# Altium schematic sheet Power.SchDoc: Power
size A; Author: Craig Hesling; DrawnBy: Craig Hesling; Revision: 3
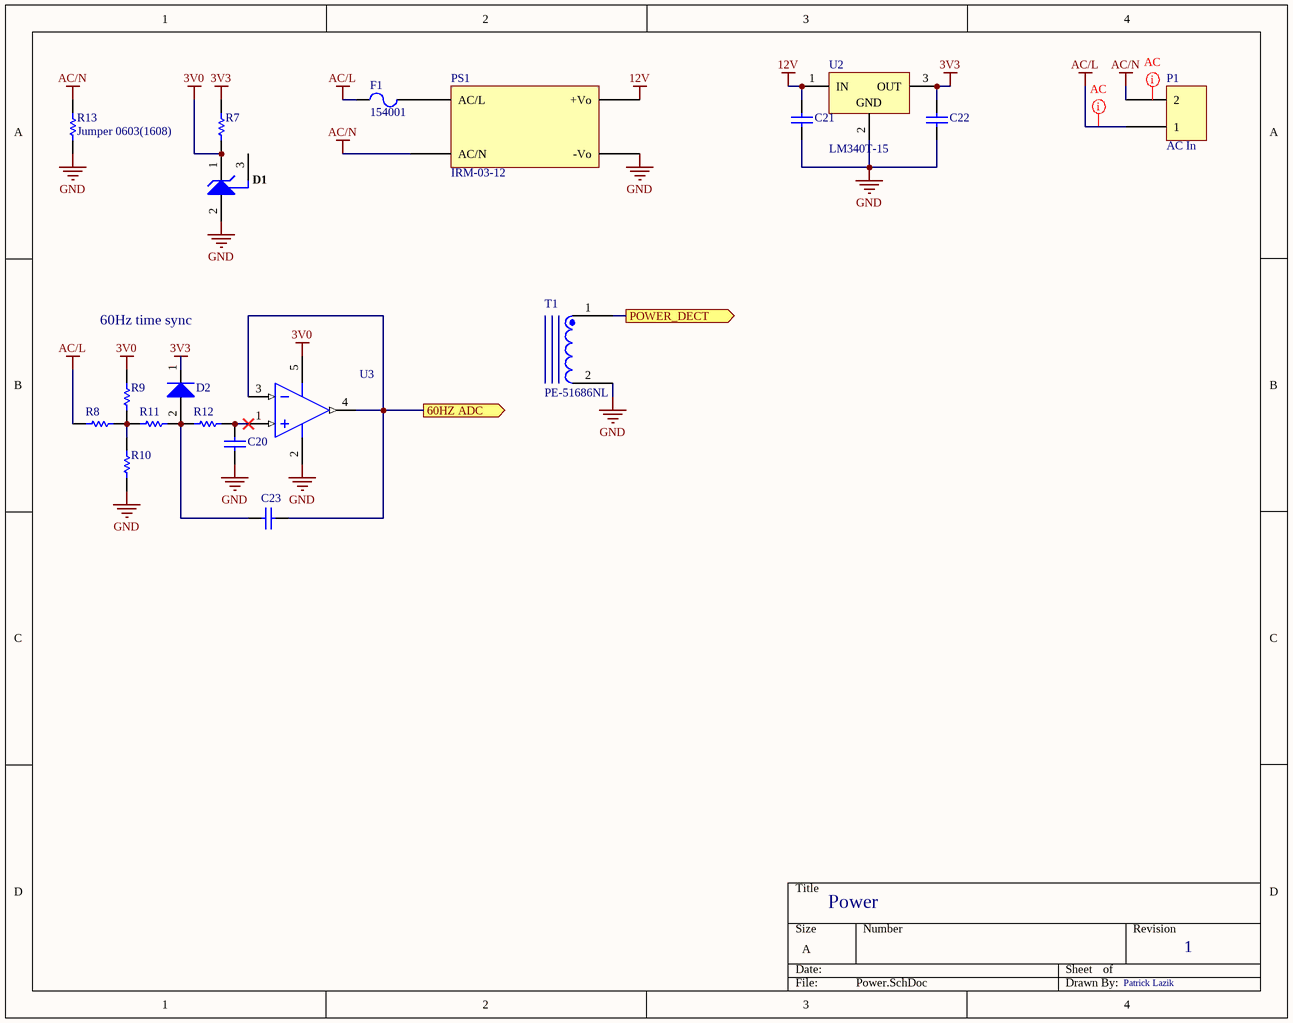
[diagram p0: Power.SchDoc]

## Parts
C20  CAP 100nF 6.3V 0603(1608)  [CAPC0603(1608)100_M]  (value not drawn)
C21  CAP 220nF 10V 0603(1608)  [CAPC0603(1608)100_L]  (value not drawn)
C22  CAP 220nF 10V 0603(1608)  [CAPC0603(1608)100_L]  (value not drawn)
C23  CAP 150nF 10V 0603(1608)  [CAPC0603(1608)100_M]  (value not drawn)
D1  LM4040A30IDBZRG4  [TI-DBZ3_N]  (value not drawn)
D2  1SS400T1  [ONSC-SOD-523-2-502-01_V]  (value not drawn)
F1  154001  [LFUS-0154001.DR_V]
P1  AC In  [PCBComponent_1]
PS1  IRM-03-12  [PCBComponent_1 - duplicate1]
R7  30R 5% 0603(1608)  [RESC0603(1608)_N]  (value not drawn)
R8  2M2 1% 0603(1608)  [RESC0603(1608)_M]  (value not drawn)
R9  33K 5% 0603(1608)  [RESC0603(1608)_N]  (value not drawn)
R10  33K 5% 0603(1608)  [RESC0603(1608)_N]  (value not drawn)
R11  3K6 5% 0603(1608)  [RESC0603(1608)_N]  (value not drawn)
R12  7K5 5% 0603(1608)  [RESC0603(1608)_M]  (value not drawn)
R13  Jumper 0603(1608)  [RESC0603(1608)_N]
T1  PE-51686NL  [PE-51686NL]
U2  LM340T-15  [NDE0003A]
U3  TLV2361IDBVRG4  [TI-DBV5_M]  (value not drawn)

## Ports
60HZ ADC (out), POWER_DECT (out)

## Nets
3V0: D1.1(CATHODE) R7.1 R9.2 U3.5(VCC+)
3V3: C22.2 D2.1(K) R7.2 U2.3(OUT)
12V: C21.2 PS1.+V(+Vo) U2.1(IN)
AC/L: F1.1 P1.1 R8.1
AC/N: P1.2 PS1.AC/N R13.2
GND: C20.1 C21.1 C22.1 D1.2(ANODE) PS1.-V(-Vo) R10.1 R13.1 T1.2 U2.2(GND) U3.2(VCC-)
60HZ ADC: C23.2 U3.3(IN-) U3.4(OUT) ; port 60HZ ADC
POWER_DECT: T1.1 ; port POWER_DECT
NetC20_2: C20.2 R12.2 U3.1(IN+)
NetC23_1: C23.1 D2.2(A) R11.2 R12.1
NetF1_2: F1.2 PS1.AC/L
NetR8_2: R8.2 R9.1 R10.2 R11.1

Not connected (* = marked no-connect by the designer): D1 3(NC)

## Layout directives
net class AC: (no net found under the mark), AC/L

## Notes on the sheet
- 60Hz time sync
- 1
- Patrick Lazik

## Library data of the parts
C20 = CMP-1035-02576-1: CAP 100nF 6.3V ±10% 0603 (1608 Metric) Thickness 1mm SMD; Case-EIA: 0603; Tolerance: Â±10%; Case-Metric: 1608; Technology: SMT; Value: 100nF; Rated Voltage: 6.3 V; Max Thickness: 1 mm
C21 C22 = CMP-1035-02640-1: CAP 220nF 10V ±10% 0603 (1608 Metric) Thickness 1mm SMD; Case-EIA: 0603; Case-Metric: 1608; Tolerance: Â±10%; Rated Voltage: 10 V; Value: 220nF; Technology: SMT; Max Thickness: 1 mm
C23 = CMP-1035-02611-1: CAP 150nF 10V ±10% 0603 (1608 Metric) Thickness 1mm SMD; Case-EIA: 0603; Case-Metric: 1608; Tolerance: Â±10%; Rated Voltage: 10 V; Value: 150nF; Max Thickness: 1 mm; Technology: SMT
D1 = CMP-0366-01119-1: Precision Micropower Shunt Voltage Reference, 0.1% accuracy, 3 V, 15 ppm / degC, 15 mA, -40 to 85 degC, 3-pin SOT-23 (DBZ), Green (RoHS & no Sb/Br); Manufacturer: Texas Instruments; Initial Accuracy @ 25/deg C(%): 0.1; VO(V): 3; Temp Coeff(Typ)(ppm/ degree C): 15; Min Iz for Regulation(uA): 62; Temp Coeff(Max)(ppm/ degree C): 100; Rating: Catalog; PackageReference: DBZ3; ComponentLink3URL: http://www.ti.com/litv/pdf/mpds108a; PackageVersion: 4203227/B; ComponentLink1Description: Manufacturer URL; Mounting Technology: Surface Mount; SubFamily: Shunt Voltage Reference; ComponentLink1URL: http://www.ti.com/; DatasheetVersion: SLOS456K; Eco-Plan: Green (RoHS & no Sb/Br); PartNumber: LM4040A30IDBZRG4; Iout/Iz(Max)(mA): 15; ComponentLink2URL: http://www.ti.com/general/docs/lit/getliterature.tsp?genericPartNumber=LM4040A30&fileType=pdf; ComponentLink2Description: Datasheet; PackageDescription: 3-Pin Plastic Small Outline, Body 2.92 x 1.3 mm, Pitch 0.95 mm; Code_JEDEC: TO-236; ComponentLink3Description: Package Specification
D2 = CMP-1054-00079-1: High-Speed Switching Diode, 2-Pin SOD-523, Pb-Free, Tape and Reel; Manufacturer: On Semiconductor; trr Max (ns): 4; Configuration: Single; IF Max (A): 0.2; PackageVersion: Rev. E, 09/2010; ComponentLink1URL: http://www.onsemi.com/; ComponentLink3URL: http://www.onsemi.com/pub_link/Collateral/502-01.PDF; ComponentLink2Description: Datasheet; Packing: Tape and Reel; ComponentLink1Description: Manufacturer URL; DatasheetVersion: Rev. 7; ComponentLink2URL: http://www.onsemi.com/pub_link/Collateral/1SS400T1-D.PDF; ComponentLink3Description: Package Specification; PartNumber: 1SS400T1; PackageReference: SOD-523-2-502-01; Mounting Technology: Surface Mount; PackageDescription: 2-Pin SOD, Body 1.2 x 0.8 mm; RoHS: TRUE
F1 = CMP-1700-00001-3: 154 Series OMNI-BLOK(R) Fuse and Holder Assembly, 125 VAC, 125 VDC, 1 A, -55 to 125 degC, 2-Pin SMD, RoHS; Mounting Technology: Surface Mount; Pins: 2; PackageDescription: 2-Pin Surface Mount Device, Body 9.73 x 5.03 mm; ComponentLink2Description: Datasheet; ComponentLink1URL: http://www.littelfuse.com/; Min Operating Temperature: -55 degC; PartNumber: 154001; ComponentLink2URL: http://www.littelfuse.com/~/media/electronics/datasheets/fuses/littelfuse_fuse_154_154t_154l_154tl_datasheet.pdf.pdf; RoHSCompliant: False; Mount: Surface Mount; ComponentLink1Description: Manufacturer URL; Max Operating Temperature: 125 degC; DatasheetVersion: Rev. Apr-16
P1 = EUROSTYLE 6 35 MM FIXED 2 CIR
R7 = CMP-1012-00037-1: 30R 0.1W 5% 0603 (1608 Metric)  SMD; Case-EIA: 0603; Value: 30.00 Ohm; Case-Metric: 1608; Power: 0.1 W; Technology: SMT; Tolerance: 5 %
R8 = CMP-1012-00885-1: 2M2 0.1W 1% 0603 (1608 Metric)  SMD; Value: 2200000.00 Ohm; Case-Metric: 1608; Case-EIA: 0603; Tolerance: 1 %; Technology: SMT; Power: 0.1 W
R9 R10 = CMP-1012-00110-1: 33K 0.1W 5% 0603 (1608 Metric)  SMD; Case-Metric: 1608; Value: 33000.00 Ohm; Case-EIA: 0603; Power: 0.1 W; Technology: SMT; Tolerance: 5 %
R11 = CMP-1012-00087-1: 3K6 0.1W 5% 0603 (1608 Metric)  SMD; Value: 3600.00 Ohm; Case-EIA: 0603; Case-Metric: 1608; Tolerance: 5 %; Technology: SMT; Power: 0.1 W
R12 = CMP-1012-00095-1: 7K5 0.1W 5% 0603 (1608 Metric)  SMD; Case-EIA: 0603; Value: 7500.00 Ohm; Case-Metric: 1608; Technology: SMT; Tolerance: 5 %; Power: 0.1 W
R13 = CMP-1012-00001-1: Jumper 0603 (1608 Metric); Power: None; Case-Metric: 1608; Value: 0.00 Ohm; Case-EIA: 0603; Technology: SMT; Tolerance: None
U2 = CMP-0062-02463-3: Series 3-Terminal Positive Regulators, 3-pin TO-220; Manufacturer: Texas Instruments; CompType: LDO IC; PowerWise: N; PackageTopMarking: NSUZXYTTE#*LM340T15*7815 P+; PinCount: 3; PackageDescription: TO-220, Molded, 3 Lead, Straight; ComponentLink1URL: http://www.ti.com/general/docs/lit/getliterature.tsp?genericPartNumber=LM340-N&fileType=pdf; PackageReference: NDE0003A; RoHS: N; ComponentLink1Description: Datasheet URL
U3 = CMP-0017-00683-1: Single High-Performance, Low-Voltage Operational Amplifier, 2 to 5 V, -40 to 85 degC, 5-pin SOT23 (DBV5), Green (RoHS & no Sb/Br); Manufacturer: Texas Instruments; Vn at 1kHz(Typ)(nV/rtHz): 9; Slew Rate(Typ)(V/us): 3; Iq per channel(Max)(mA): 2.25; Number of Channels: 1; CMRR(Min)(dB): 85; Sub Family: General Purpose Amplifier, Low Noise Amp (<=10nV/rtHz), Low Supply Voltage Amplifier (<=2.7V); Vio (25C)(Max)(mV): 6; IIB(Max)(pA): 150000; Total Supply Voltage(Min)(+5V is 5, +/-5V is 10): 2; Total Supply Voltage(Max)(+5V is 5, +/-5V is 10): 5; PackageDescription: 5-Pin Plastic Small Outline, Body 1.6 x 2.9 mm, Pitch 0.95 mm; PackageVersion: 4073253-4/K, 03/2006; Eco-Plan: Green (RoHS & no Sb/Br); DatasheetVersion: SLOS195H; ComponentLink1URL: http://www.ti.com/; Mounting Technology: Surface Mount; ComponentLink3URL: http://www.ti.com/litv/pdf/mpds018i; ComponentLink2Description: Datasheet; ComponentLink1Description: Manufacturer URL; GBW(Typ)(MHz): 6; ComponentLink2URL: http://www.ti.com/lit/ds/symlink/tlv2361.pdf; PackageReference: DBV5; PartNumber: TLV2361IDBVRG4; ComponentLink3Description: Package Specification; Code_JEDEC: MO-178